# EAGLE schematic relay_sch (EAGLE 6.5.0)
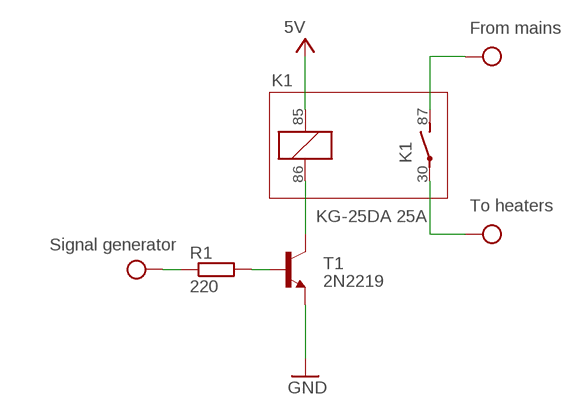
[diagram p0: schematic, sheet 1]

## Parts
K1  KG-25DA 25A  CM1AF-P-12V  [CM]
R1  220  R-EU_0204/2V  [0204V]
T1  2N2219  [TO5]

## Nets
GND: T1.1(E)
N$1: K1.86 T1.3(C)
N$4: R1.2 T1.2(B)
VCC: K1.30(2:P) K1.85 K1.87(2:S) R1.1 ; supply symbol labelled 5V, Signal generator, From mains, To heaters

## Library data of the parts
K1 = relay:CM1A*: AUTOMOTIVE MICRO-ISO RELAY NAiS en_ds_61204_0000.pdf; MF: AROMAT/ MATSUSHITA; MPN: CM1AF-P-12V; OC_FARNELL: unknown; OC_NEWARK: 10C5497
R1 = rcl:R-EU_: RESISTOR, European symbol
T1 = transistor:2N2219: NPN TRANSISTOR